# EAGLE design H-bridge (EAGLE 8.0.1)
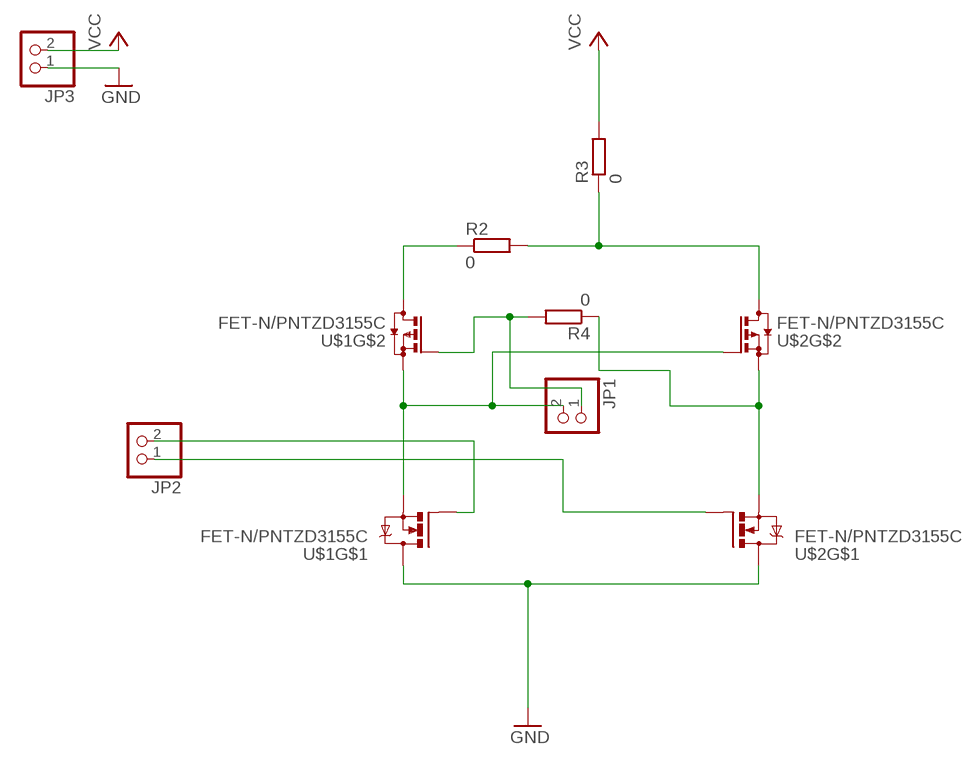
[diagram p0: schematic, sheet 1]

## Parts
JP1  PINHD-1X2  [1X02]
JP2  PINHD-1X2  [1X02]
JP3  PINHD-1X2  [1X02]
R2  0  R_0805  [R0805]
R3  0  R_0805  [R0805]
R4  0  R_0805  [R0805]
U$1  FET-N/PNTZD3155C  [SOT-563]
U$2  FET-N/PNTZD3155C  [SOT-563]

## Nets
GND: JP3.1 U$1.6(D) U$2.6(D)
N$5: R4.1 U$2.1(S) U$2.4(S)
N$7: JP1.2 U$1.1(S) U$1.4(S) U$2.5(G)
N$8: JP2.1 U$2.2(G)
N$9: R2.1 U$1.3(D)
N$10: R2.2 R3.1 U$2.3(D)
N$11: JP1.1 R4.2 U$1.5(G)
N$12: JP2.2 U$1.2(G)
VCC: JP3.2 R3.2

## Library data of the parts
JP1-JP3 = pinhead:PINHD-1X2: PIN HEADER
R2-R4 = Namenlos:R_
U$1 U$2 = Namenlos:FET-N/P

## Board
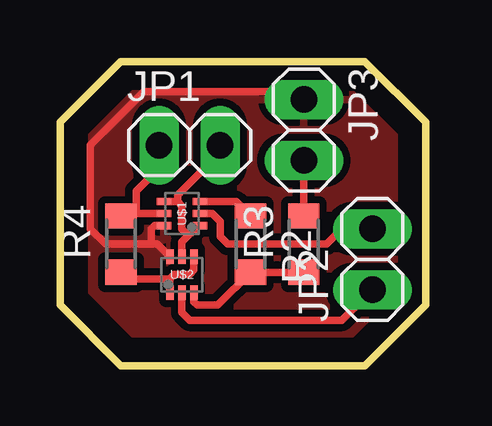
[diagram p1: board, top side]

Size 15.24 x 12.7 mm. Coordinates in mm from the lower left corner, seen from the top.
Outline: 12.7,0 2.54,0 0,2.54 0,10.16 2.54,12.7 12.7,12.7 15.24,10.16 15.24,2.54 12.7,0
Copper layers (1*16): Top 0.035mm / dielectric 1.5mm / Bottom 0.035mm
Design rules "default": minimum track width 10mil, minimum drill 24mil, track to track 8mil, track to pad 8mil, pad to pad 8mil, via to via 8mil, smd to smd 8mil, copper to edge 40mil, drill to drill 8mil, minimum pad ring 10mil, minimum via ring 8mil, stop-mask expansion 4mil, vias tented up to drill 0mil, thermal gap 10mil

### Footprints (pad centres in the part's own frame; a part is rotated, then mirrored left to right if it is on the bottom)
1X02 = drill 1.1 long: 1 -1.27,0; 2 1.27,0
R0805 = smd 1.05 x 1.3: 1 -1.175,0; 2 1.175,0
SOT-563 = smd 0.3 x 0.6: 1 -0.5,-0.75; 2 0,-0.75; 3 0.5,-0.75; 4 0.5,0.75; 5 0,0.75; 6 -0.5,0.75

### Placement (x,y rotation side)
JP1  5.4,9.21 0 top
JP2  13.02,4.45 90 top
JP3  10.16,9.84 270 top
R2  7.94,5.08 270 top
R3  10.16,5.08 90 top
R4  2.54,5.08 90 top
U$1  5.08,6.35 90 top
U$2  5.08,3.81 0 top

### Tracks (layer width: path | path; a pad name or v marks a point on that pad's centre or on a via)
GND
  Top 0.305: 3.81,5.08 1.91,5.08 1.27,5.72 1.27,9.21 3.49,11.43 9.84,11.43 JP3.1 | 3.81,5.08 4.06,5.08 U$2.6 | U$1.6 3.94,5.85 3.81,5.72 3.81,5.08
  pour Top (isolate 0.305): 0,2.54 0,10.16 2.54,12.7 12.7,12.7 15.24,10.16 15.24,2.54 12.7,0 2.54,0
N$5
  Top 0.305: U$2.1 4.58,3.63 | 4.58,3.63 4.76,3.81 5.4,3.81 5.58,3.99 U$2.4 | 4.58,3.63 2.82,3.63 R4.1
N$7
  Top 0.305: U$2.5 5.08,5.17 5.35,5.45 | 5.35,5.45 U$1.1 | U$1.4 4.9,6.85 | 4.9,6.85 5.08,6.67 5.08,5.72 5.35,5.45 | JP1.2 6.67,8.89 4.9,7.12 4.9,6.85
N$8
  Top 0.305: U$2.2 5.08,2.22 5.4,1.91 11.75,1.91 JP2.1
N$9
  Top 0.305: U$1.3 7.34,6.85 R2.1
N$10
  Top 0.305: U$2.3 5.58,2.67 5.71,2.54 6.57,2.54 R2.2 R3.1
N$11
  Top 0.305: 3.17,6.35 U$1.5 | 3.17,6.35 2.63,6.35 R4.2 | JP1.1 4.13,8.25 3.17,7.3 3.17,6.35
N$12
  Top 0.305: U$1.2 6.35,6.35 6.67,6.03 6.67,5.4 6.98,5.08 11.11,5.08 11.75,5.72 JP2.2
VCC
  Top 0.305: R3.2 JP3.2